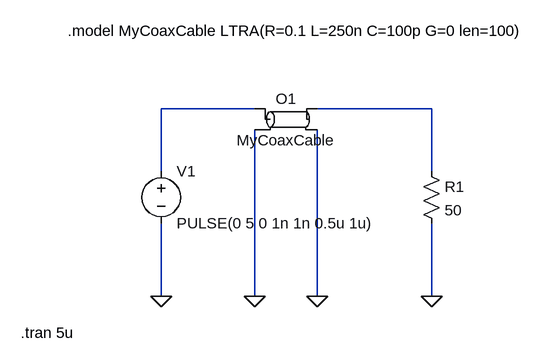
[diagram p0: schematic WiredMedia (exp3) .asc]
WiredMedia (exp3) .asc, the LTspice schematic file:
Version 4.1
SHEET 1 1076 680
WIRE 224 0 80 0
WIRE 496 0 320 0
WIRE 80 96 80 0
WIRE 496 96 496 0
WIRE 80 288 80 176
WIRE 224 288 224 32
WIRE 320 288 320 32
WIRE 496 288 496 176
FLAG 80 288 0
FLAG 224 288 0
FLAG 320 288 0
FLAG 496 288 0
SYMBOL voltage 80 80 R0
WINDOW 123 0 0 Left 0
WINDOW 39 0 0 Left 0
SYMATTR InstName V1
SYMATTR Value PULSE(0 5 0 1n 1n 0.5u 1u)
SYMBOL ltline 272 16 R0
SYMATTR InstName O1
SYMATTR Value MyCoaxCable
SYMBOL res 480 80 R0
SYMATTR InstName R1
SYMATTR Value 50
TEXT -64 -120 Left 2 !.model MyCoaxCable LTRA(R=0.1 L=250n C=100p G=0 len=100)
TEXT -136 344 Left 2 !.tran 5u

The netlist it stands for:
* WiredMedia (exp3) .asc
V1 N001 0 PULSE(0 5 0 1n 1n 0.5u 1u)
O1 N001 0 N002 0 MyCoaxCable
R1 N002 0 50
.model MyCoaxCable LTRA(R=0.1 L=250n C=100p G=0 len=100)
.tran 5u
.backanno
.end